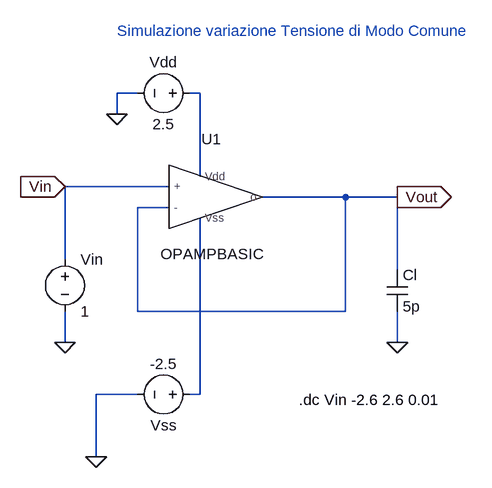
[diagram p0: schematic VinCM_Basic.asc]
VinCM_Basic.asc, the LTspice schematic file:
Version 4
SHEET 1 880 680
WIRE 0 -48 -32 -48
WIRE 96 -48 80 -48
WIRE -32 -16 -32 -48
WIRE 96 80 96 -48
WIRE 48 96 -112 96
WIRE 320 112 192 112
WIRE 400 112 320 112
WIRE 48 128 0 128
WIRE -112 208 -112 96
WIRE 400 224 400 112
WIRE 0 288 0 128
WIRE 320 288 320 112
WIRE 320 288 0 288
WIRE -112 336 -112 288
WIRE 400 336 400 288
WIRE 0 416 -64 416
WIRE 96 416 96 144
WIRE 96 416 80 416
WIRE -64 512 -64 416
FLAG 400 336 0
FLAG -112 336 0
FLAG -32 -16 0
FLAG -64 512 0
FLAG -112 96 Vin
IOPIN -112 96 In
FLAG 400 112 Vout
IOPIN 400 112 Out
SYMBOL AutoGenerated\\OPAMPBASIC 112 112 R0
WINDOW 0 2 -74 Bottom 2
WINDOW 3 2 72 Top 2
SYMATTR InstName U1
SYMBOL cap 384 224 R0
SYMATTR InstName Cl
SYMATTR Value 5p
SYMBOL voltage -112 192 R0
WINDOW 123 0 0 Left 0
WINDOW 39 0 0 Left 0
SYMATTR InstName Vin
SYMATTR Value 1
SYMBOL voltage 96 -48 R90
WINDOW 0 -32 56 VBottom 2
WINDOW 3 32 56 VTop 2
SYMATTR InstName Vdd
SYMATTR Value 2.5
SYMBOL voltage 96 416 R90
WINDOW 0 32 56 VTop 2
WINDOW 3 -32 56 VBottom 2
WINDOW 123 0 0 Left 0
WINDOW 39 0 0 Left 0
SYMATTR InstName Vss
SYMATTR Value -2.5
TEXT -32 -144 Left 2 ;Simulazione variazione Tensione di Modo Comune
TEXT 248 424 Left 2 !.dc Vin -2.6 2.6 0.01

The netlist it stands for:
* VinCM_Basic.asc
XU1 Vin Vout Vout N001 N002 OPAMPBASIC  ; pins + - o Vdd Vss
Cl Vout 0 5p
Vin Vin 0 1
Vdd N001 0 2.5
Vss N002 0 -2.5
* Simulazione variazione Tensione di Modo Comune
.dc Vin -2.6 2.6 0.01
.lib C:\Users\andre\Desktop\Universita\PrimoAnno\SecondoSemestre\ProgettiAnalogici\OpAmpProject\Basic\OpAmpBasic.cir
.backanno
.end